# Altium project Encoder.PrjPcb
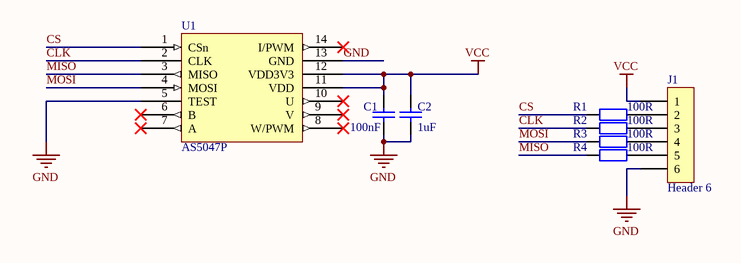
[diagram p0: Encoder.SchDoc]
1 sheet, 8 parts. Net scope: global (net labels, ports and power ports of the same name join across sheets).
Board file: Encoder.PcbDoc

## Sheet Encoder.SchDoc: Encoder
size A4; Date: 9/28/2024; DocumentNumber: 1; Revision: 1; SheetNumber: 1; SheetTotal: 1

### Parts
C1  value 100nF  [0603C]  (hidden comment: Capacitor)
C2  value 1uF  [0603C]  (hidden comment: Capacitor)
J1  Header 6  [Pin HDR1X6/2.54mm-S]
R1  value 100R  [0603R]  (hidden comment: Res2)
R2  value 100R  [0603R]  (hidden comment: Res2)
R3  value 100R  [0603R]  (hidden comment: Res2)
R4  value 100R  [0603R]  (hidden comment: Res2)
U1  AS5047P  [TSSOP-14]

### Nets
GND: C1.1 C2.1 J1.6 U1.5(TEST) U1.13(GND)
VCC: C1.2 C2.2 J1.1 U1.11(VDD) U1.12(VDD3V3)
CLK: R2.1 U1.2(CLK)
CS: R1.1 U1.1(CSn)
MISO: R4.1 U1.3(MISO)
MOSI: R3.1 U1.4(MOSI)
NetJ1_2: J1.2 R1.2
NetJ1_3: J1.3 R2.2
NetJ1_4: J1.4 R3.2
NetJ1_5: J1.5 R4.2

Not connected (* = marked no-connect by the designer): U1 6(B)* 7(A)* 8(W/PWM)* 9(V)* 10(U)* 14(I/PWM)*

### Library data of the parts
C1 C2 = Cap: Published: 8-Jun-2000; LatestRevisionDate: 17-Jul-2002; LatestRevisionNote: Re-released for DXP Platform.; PackageReference: RAD-0.3; Publisher: Altium Limited; PackageDescription: Radial Cap, Thru-Hole; 2 Leads; 0.3 in Pin Spacing
R1-R4 = Res2: Resistor; Published: 8-Jun-2000; LatestRevisionDate: 17-Jul-2002; LatestRevisionNote: Re-released for DXP Platform.; PackageReference: AXIAL-0.4; Publisher: Altium Limited; PackageDescription: Axial Device, Thru-Hole; 2 Leads; 0.4 in Pin Spacing